# EAGLE design H0FR1 (EAGLE 9.6.1)

## Sheet 1 of 2
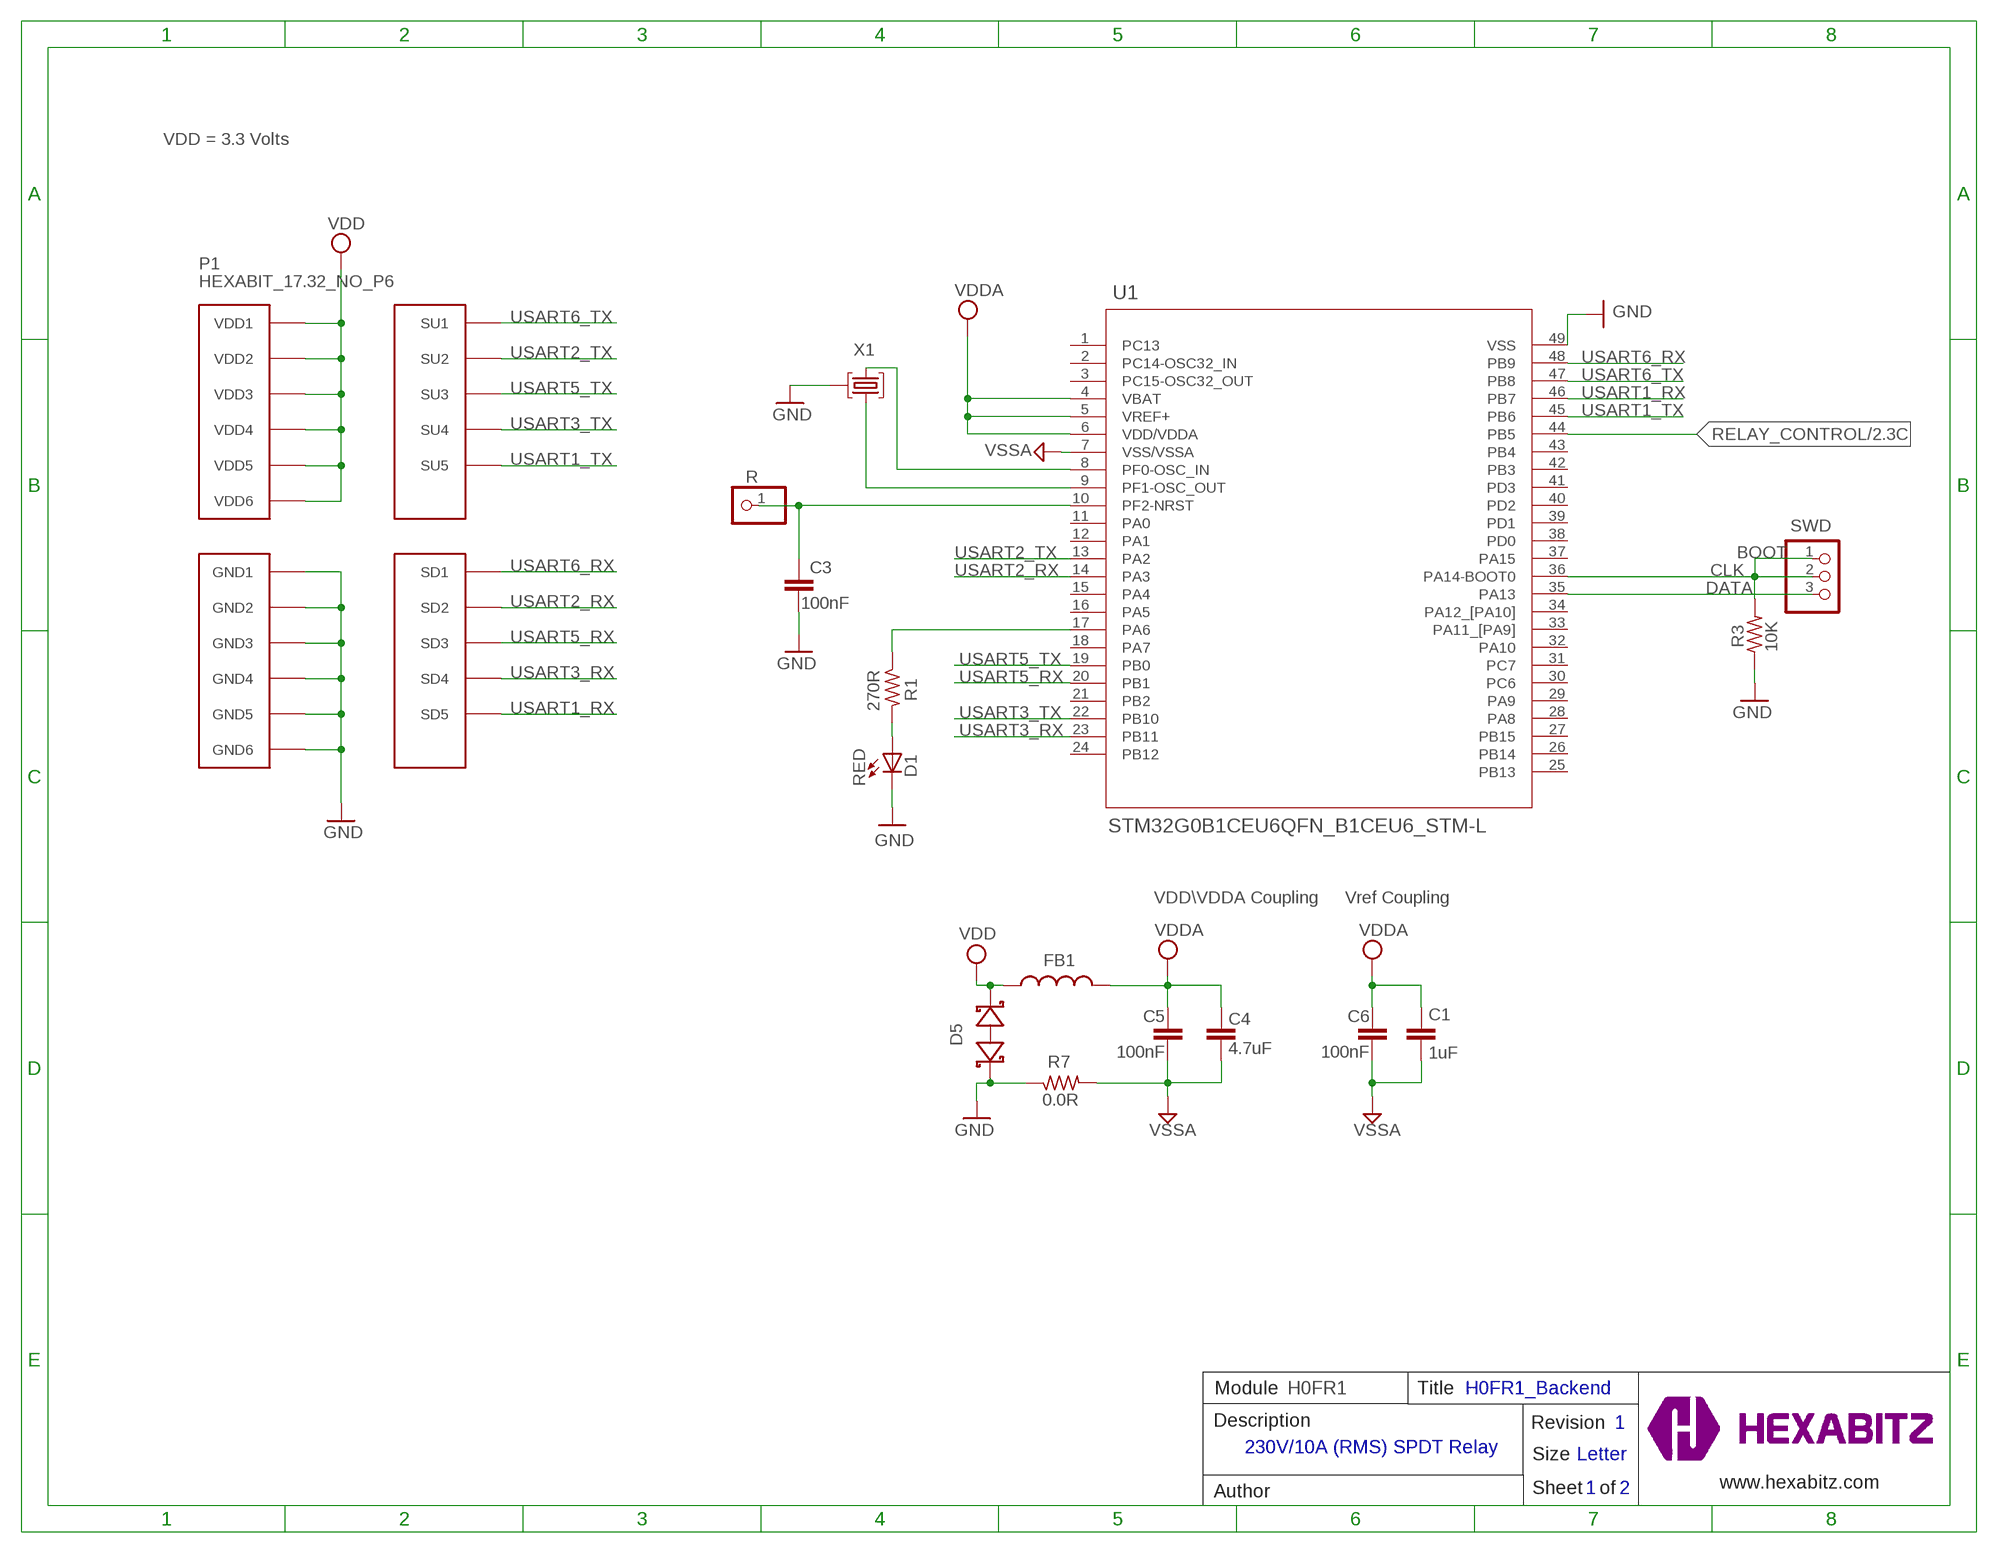
[diagram p0: schematic, sheet 1]

### Parts
C1  1uF  C-0805  [C-0805]
C3  100nF  C-0603  [C-0603]
C4  4.7uF  C-0805  [C-0805]
C5  100nF  C-0603  [C-0603]
C6  100nF  C-0603  [C-0603]
D1  RED  VLMS1300-GS08  [VLMS1300-GS08]
D5  BOURNS_CDSOD323-T03SCBOURNS_CDSOD323-T03SC_0_0  [BOURNS_CDSOD323-T03SC_0]
FB1  FB-TDK_MMZ1608Y300B  FB-0603  [FB-0603]
P1  HEXABIT_17.32_NO_P6  [HEXABIT_17.32_NO_P6]
R  R  PINHD-1X1  [1X01]
R1  270R  R-0603  [R-0603]
R3  10K  R-0603  [R-0603]
R7  0.0R  R-0603  [R-0603]
SWD  PINHD-1X3  [1X03]
TRIMBLE-LOGO1  HEXA-LOGO  [HEXA-LOGO]
U1  STM32G0B1CEU6QFN_B1CEU6_STM-L  [QFN_B1CEU6_STM-L]
X1  XTALL_CSTCE8M00G52  [XTALL_CSTCE8M00G52]

### Nets
CLK: R3.2 SWD.1 SWD.2 U1.36(PA14-BOOT0)
DATA: SWD.3 U1.35(PA13)
GND: C3.2 D1.C D5.1(A) P1.PAD_PD7(GND1) P1.PAD_PD8(GND2) P1.PAD_PD9(GND3) P1.PAD_PD10(GND4) P1.PAD_PD11(GND5) P1.PAD_PD12(GND6) R3.1 R7.1 U1.49(VSS) X1.P$2 ; also sheet 2
N$2: D1.A R1.2
N$3: R1.1 U1.17(PA6)
N$4: C3.1 R.1 U1.10(PF2-NRST)
N$5: U1.9(PF1-OSC_OUT) X1.P$1
N$6: U1.8(PF0-OSC_IN) X1.P$3
RELAY_CONTROL: U1.44(PB5) ; also sheet 2
USART1_RX: P1.PAD_PD5(SD5) U1.46(PB7)
USART1_TX: P1.PAD_PU5(SU5) U1.45(PB6)
USART2_RX: P1.PAD_PD2(SD2) U1.14(PA3)
USART2_TX: P1.PAD_PU2(SU2) U1.13(PA2)
USART3_RX: P1.PAD_PD4(SD4) U1.23(PB11)
USART3_TX: P1.PAD_PU4(SU4) U1.22(PB10)
USART5_RX: P1.PAD_PD3(SD3) U1.20(PB1)
USART5_TX: P1.PAD_PU3(SU3) U1.19(PB0)
USART6_RX: P1.PAD_PD1(SD1) U1.48(PB9)
USART6_TX: P1.PAD_PU1(SU1) U1.47(PB8)
VDD: D5.2(C) FB1.2 P1.PAD_PU7(VDD1) P1.PAD_PU8(VDD2) P1.PAD_PU9(VDD3) P1.PAD_PU10(VDD4) P1.PAD_PU11(VDD5) P1.PAD_PU12(VDD6) ; also sheet 2
VDDA: C1.1 C4.1 C5.1 C6.1 FB1.1 U1.4(VBAT) U1.5(VREF+) U1.6(VDD/VDDA)
VSSA: C1.2 C4.2 C5.2 C6.2 R7.2 U1.7(VSS/VSSA)
Unconnected: U1.1(PC13) U1.2(PC14-OSC32_IN) U1.3(PC15-OSC32_OUT) U1.11(PA0) U1.12(PA1) U1.15(PA4) U1.16(PA5) U1.18(PA7) U1.21(PB2) U1.24(PB12) U1.25(PB13) U1.26(PB14) U1.27(PB15) U1.28(PA8) U1.29(PA9) U1.30(PC6) U1.31(PC7) U1.32(PA10) U1.33(PA11_[PA9]) U1.34(PA12_[PA10]) U1.37(PA15) U1.38(PD0) U1.39(PD1) U1.40(PD2) U1.41(PD3) U1.42(PB3) U1.43(PB4)

### Notes on the sheet
- VDD = 3.3 Volts
- BOOT
- VDD\VDDA Coupling | Vref Coupling
- Module | H0FR1 | Title | H0FR1_Backend
- Description | Revision | 1
- 230V/10A (RMS) SPDT Relay
- Size | Letter
- www.hexabitz.com
- Author | Sheet   of | 1 | 2
- C:/Users/Admin/Desktop/logodraft.bmp

## Sheet 2 of 2
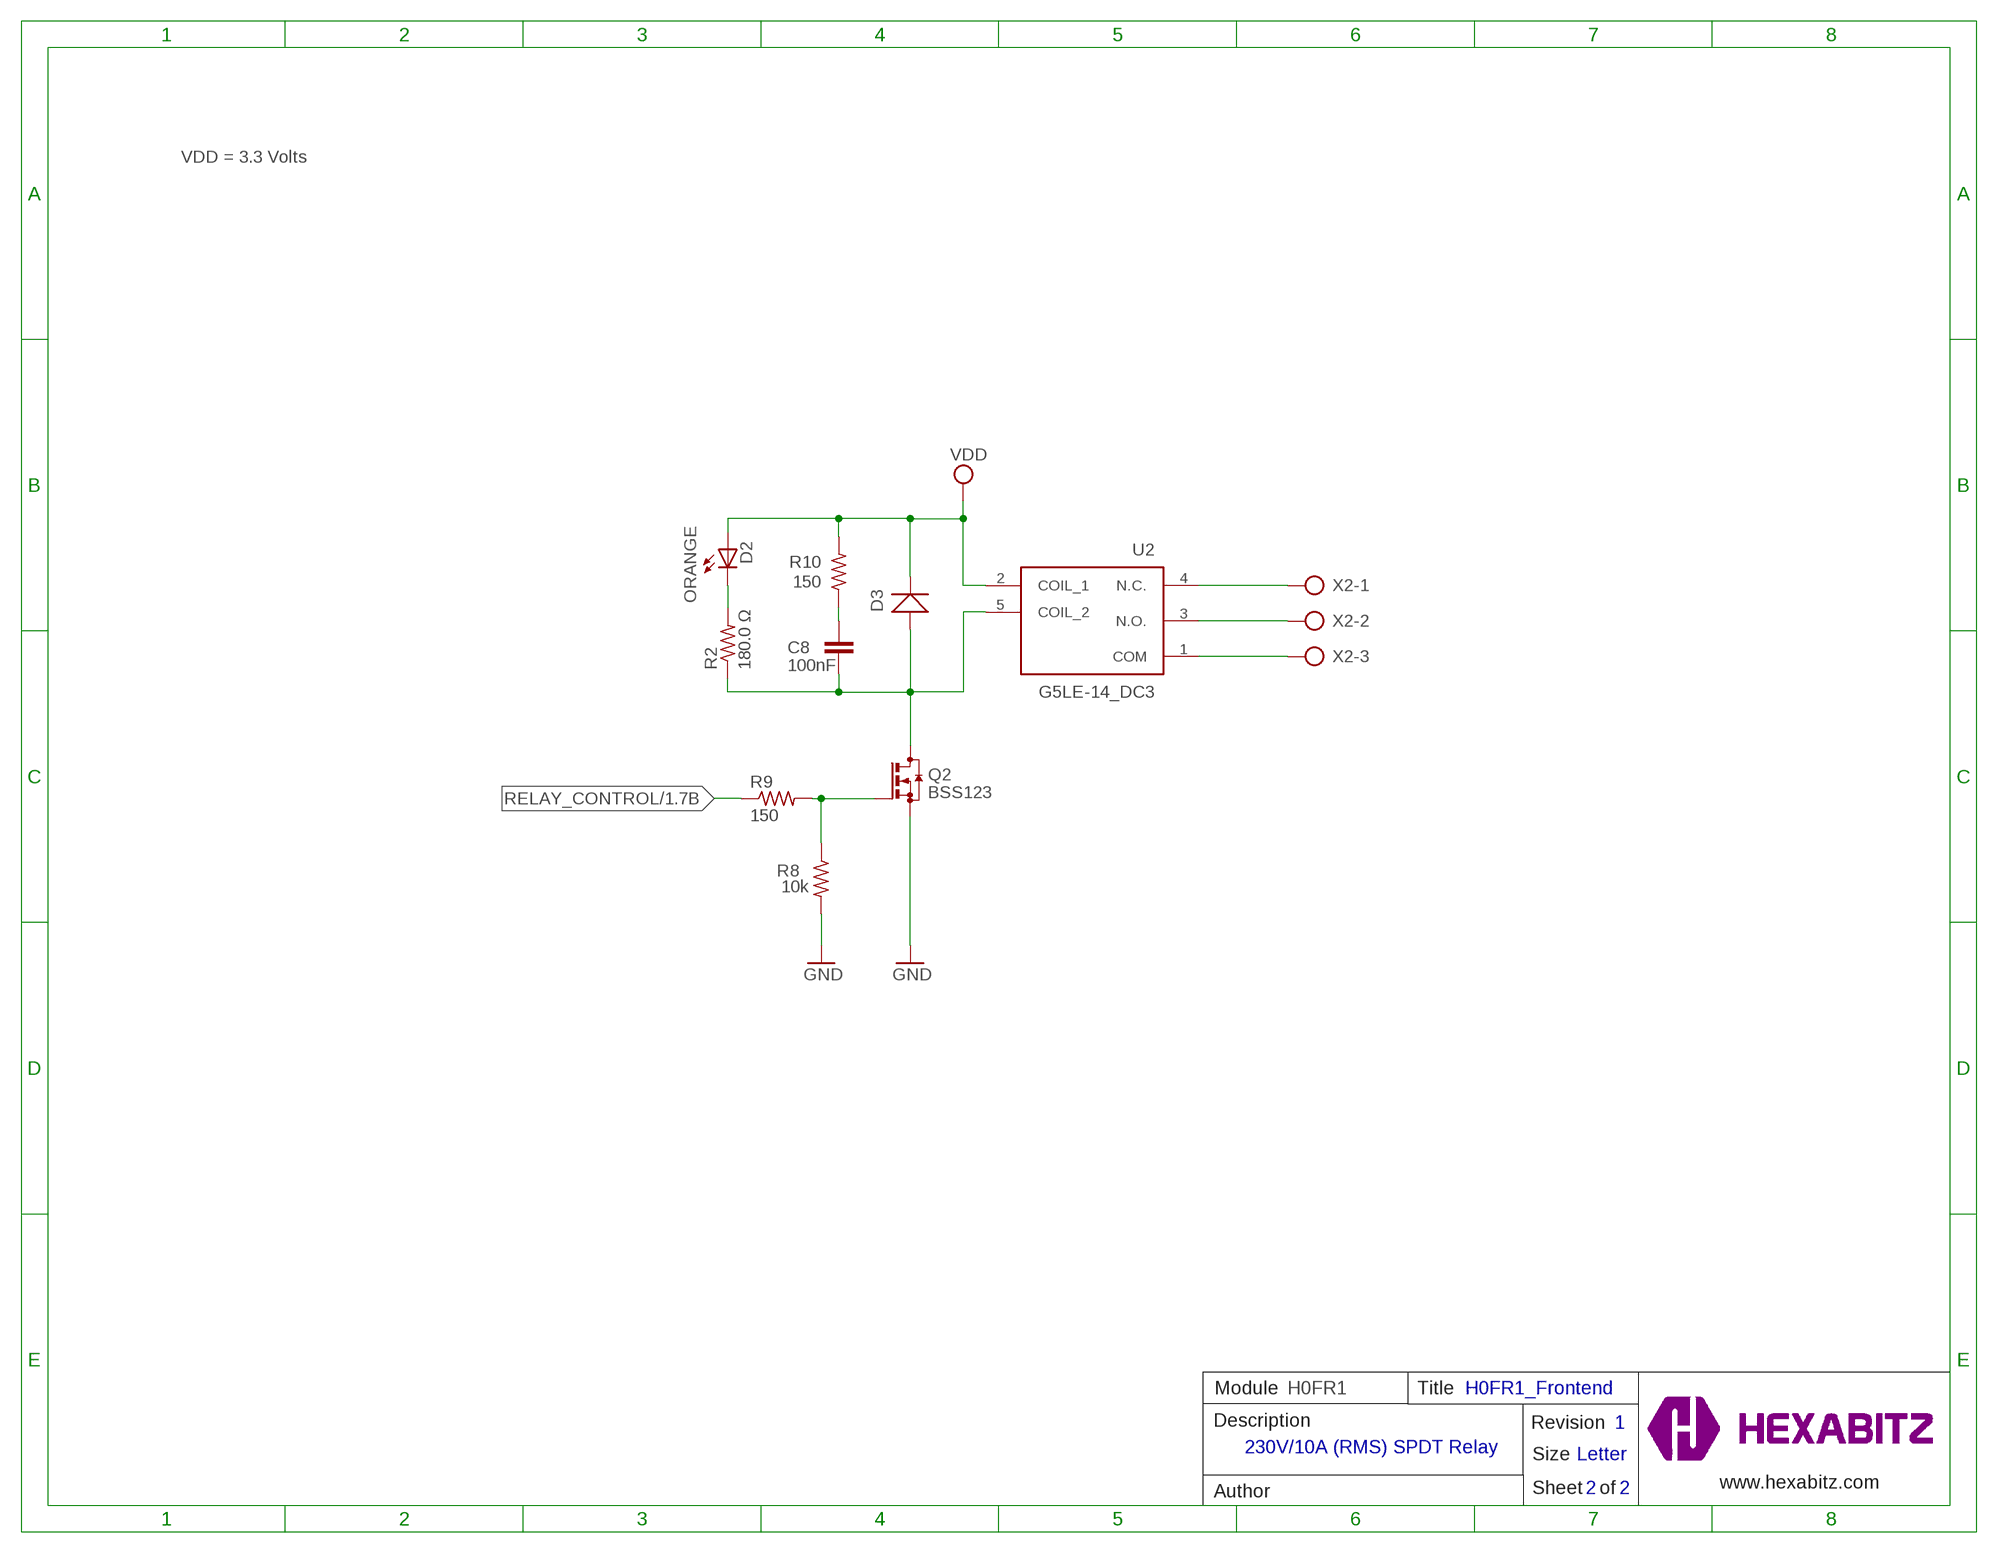
[diagram p1: schematic, sheet 2]

### Parts
C8  100nF  C-0603  [C-0603]
D2  orange  VLMS1300-GS08  [VLMS1300-GS08]
D3  40V 300MA  BAT54JFILM_SOD-323  [SOD-323]
Q2  BSS123  [SOT23]
R2  180.0 Ω  R-0603  [R-0603]
R8  10k  R-0603  [R-0603]
R9  150  R-0603  [R-0603]
R10  150  R-0603  [R-0603]
U2  G5LE-14_DC3  [G5LE-14_SPDT]
X2  AK300/3  [AK300/3]

### Nets
COM [ac]: U2.1(COM) X2.3
GND: Q2.2(S) R8.2 ; also sheet 1
N$1: C8.2 D3.+ Q2.3(D) R2.1 U2.5(COIL_2)
N$8: D2.C R2.2
N$11: Q2.1(G) R8.1 R9.2
N$12: C8.1 R10.1
NC [ac]: U2.4(N.C.) X2.1
NO [ac]: U2.3(N.O.) X2.2
RELAY_CONTROL: R9.1 ; also sheet 1
VDD: D2.A D3.- R10.2 U2.2(COIL_1) ; also sheet 1

### Notes on the sheet
- VDD = 3.3 Volts
- Module | H0FR1 | Title | H0FR1_Frontend
- Description | Revision | 1
- 230V/10A (RMS) SPDT Relay
- Size | Letter
- www.hexabitz.com
- Author | Sheet   of | 2 | 2

## Library data of the parts
C1 C4 = HEXABITZ_RCLS:C-0805: CAP CER 10% X7R 0805
C3 C5 C6 = HEXABITZ_RCLS:C-0603: CAP CER 10% X7R 0603
C8 = HEXABITZ_RCLS:C-0603: CAP CER 10% X7R 0603; CAPACITANCE: 100nF; MFN: KEMET; MPN: C0603C104K8RACTU; OCTOPART_URL: https://octopart.com/c0603c104k8ractu-kemet-145075?r=sp&s=9bS9ASSwSEqMCE9KBEQZ0g; TOLERANCE: 10%; VOLTAGE_RATING: 10V
D1 = HEXABITZ_USER_INTERFACE_PARTS:VLMS1300-GS08: Red 0603 130° Clear 54 mcd 2 V Surface Mount ChipLED ; Octopart Url : http://octopart.com/vlms1300-gs08-vishay-21709201; MFN: Vishay; MPN: VLMS1300-GS08; OCTOPART_URL: https://octopart.com/vlms1300-gs08-vishay-21709201?r=sp&s=_gcP4_q8T1SC6PJQPTQ9yA
D2 = Hexabitz:VLMS1300-GS08: Red 0603 130° Clear 54 mcd 2 V Surface Mount ChipLED ; Octopart Url : http://octopart.com/vlms1300-gs08-vishay-21709201; COULOR: ORANGE; MFN: Vishay; MPN: VLMY1300-GS08; OCTOPART_URL: https://octopart.com/vlmy1300-gs08-vishay-21709204; VALUE: RED
D3 = HEXABITZ_RCLS:BAT54JFILM_SOD-323: 304020019; MPN: BAT54JFILM
D5 = HEXABITZ_RCLS:BOURNS_CDSOD323-T03SC: CDSOD323-TxxSC - TVS Diode Series; DESCRIPTION: Dio Tvs Vwm 03V 500W Bidir Sod323 / Tape & Reel - 7" Reel; MFN: Bourns; MPN: CDSOD323-T03SC; OCTOPART_URL: https://octopart.com/cdsod323-t03sc-bourns-10487153?r=sp
FB1 = HEXABITZ_RCLS:FB-0603: Ferrite Beads Multi-Layer 0603; MFN: TDK; MPN: MMZ1608Y300B; OCTOPART_URL: https://octopart.com/mmz1608y300b-tdk-368280?r=sp&s=cd9_2ZEqQ9q9UNBuQgHAiA
P1 = hexabitz_connectors:HEXABIT_?_NO_P6: Hexabitz Hexagon Module Connector Hexagon side length = 17.32mm. The following ports are removed: P6
Q2 = HEXABITZ_RCLS:BSS123: N-CHANNEL MOS FET; DESCRIPTION: Transistor MOSFET Negative Channel 100 Volt 0.17A 3-Pin SOT-23; MFN: ON Semiconductor; MPN: BSS123; OCTOPART_URL: https://octopart.com/bss123-on+semiconductor-20837328?r=sp
R = HEXABITZ_USER_INTERFACE_PARTS:PINHD-1X1: PIN HEADER; MFN: TE Connectivity; MPN: 87227-1; OCTOPART_URL: https://octopart.com/87227-1-te+connectivity-39512052?r=sp
R1 R3 = HEXABITZ_RCLS:R-0603: Thick Film Resistors - SMD 0603
R2 = HEXABITZ_RCLS:R-0603: Thick Film Resistors - SMD 0603; MFN: Panasonic; MPN: ERJ-3GEYJ181V; OCTOPART_URL: https://octopart.com/erj-3geyj181v-panasonic-55403673; RESISTANCE: 180.0 Ω; TOLERANCE: ±5%
R7 = HEXABITZ_RCLS:R-0603: Thick Film Resistors - SMD 0603; MFN: Yageo; MPN: RC0603JR-070RL; OCTOPART_URL: https://octopart.com/rc0603jr-070rl-yageo-1241539?r=sp&s=X2NteqRjRNWrnx42Y0aliA; RESISTANCE: 0.0 Ohm
R8 R10 = HEXABITZ_RCLS:R-0603: Thick Film Resistors - SMD 0603; MFN: Yageo; MPN: RC0603JR-07680KL; OCTOPART_URL: https://octopart.com/rc0603jr-07680kl-yageo-40953169?r=sp; RESISTANCE: 680K Ohm; TOLERANCE: 5%
R9 = HEXABITZ_RCLS:R-0603: Thick Film Resistors - SMD 0603; MFN: Vishay; MPN: CRCW06031K00JNEA; OCTOPART_URL: https://octopart.com/crcw06031k00jnea-vishay-55388219?r=sp; RESISTANCE: 1000.0 Ω; TOLERANCE: ±5%
SWD = pinhead:PINHD-1X3: PIN HEADER
TRIMBLE-LOGO1 = HEXABITZ_USER_INTERFACE_PARTS:HEXA-LOGO: Trimble-Logo
U1 = HEXABITZ_ICs:STM32G0B1CEU6; COPYRIGHT: Copyright (C) 2021 Ultra Librarian. All rights reserved.; MANUFACTURER_PART_NUMBER: STM32G0B1CEU6; MFR_NAME: STMicroelectronics; SPICEPREFIX: X
U2 = HEXABITZ_OTHER_PARTS:G5LE-14_DC: General Purpose Relays Power PCB Relay Source: Datasheet <https://omronfs.omron.com/en_US/ecb/products/pdf/en-g5le.pdf>; DESCRIPTION: General Purpose Relays Power PCB Relay; HEIGHT: mm; MANUFACTURER_NAME: Omron Electronics; MANUFACTURER_PART_NUMBER: G5LE-14 DC3; MOUSER_PART_NUMBER: 653-G5LE-14DC3; MOUSER_PRICE-STOCK: https://www.mouser.com/Search/Refine.aspx?Keyword=653-G5LE-14DC3
X1 = HEXABITZ_RCLS:XTALL_CSTCE8M00G52: MURATA CSTCE8M00G52-R0 RESONATOR, SMD, 8MHZ ; Octopart Url : https://octopart.com/cstce8m00g52-r0-murata-7145559; MFN: Murata; MPN: CSTCE8M00G52Z-R0; OCTOPART_URL: https://octopart.com/cstce8m00g52z-r0-murata-17755941?r=sp&s=JDnNJnrHQhyS8Zk4ofFWXw
X2 = HEXABITZ_CONNECTION_PARTS:AK300/3: CONNECTOR; OC_FARNELL: unknown; OC_NEWARK: unknown

## Net classes
1 ac: clearance 1.016 mm

## Board
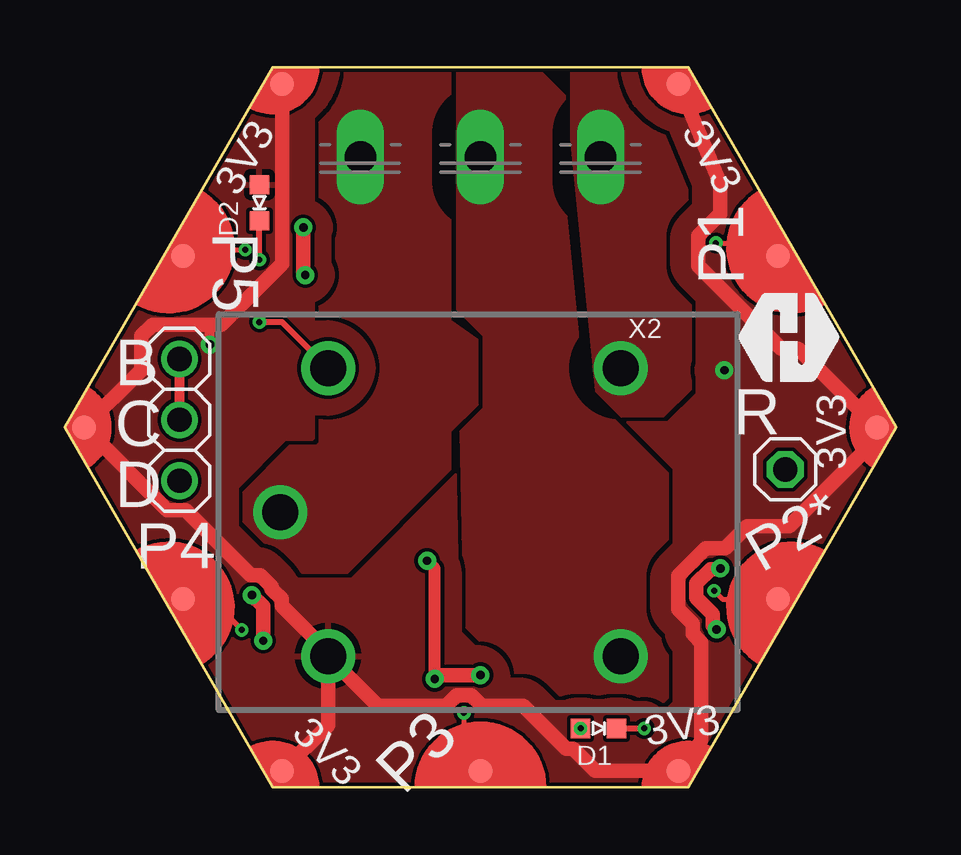
[diagram p2: board, top side]
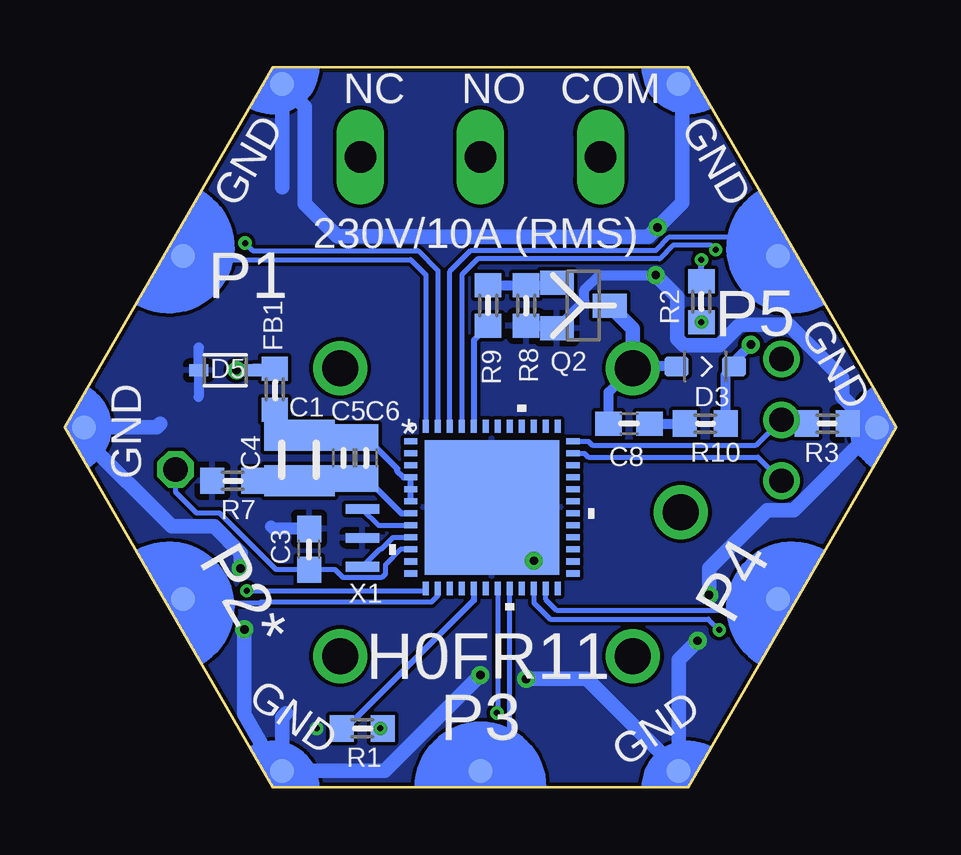
[diagram p3: board, bottom side, seen from below]

Size 34.64 x 30 mm. Coordinates in mm from the lower left corner, seen from the top.
Copper layers (1*16): Top 0.035mm / dielectric 1.5mm / Bottom 0.035mm
Design rules "2_layer *": minimum track width 6mil, minimum drill 9mil, track to track 6mil, track to pad 6mil, pad to pad 6mil, via to via 6mil, smd to smd 0mil, copper to edge 0.15mm, drill to drill 8mil, minimum pad ring 10mil, minimum via ring 6mil, stop-mask expansion 2mil, vias tented up to drill 15mil, thermal gap 10mil

### Footprints (pad centres in the part's own frame; a part is rotated, then mirrored left to right if it is on the bottom)
C-0805 = smd 1.3 x 1.5: 1 -0.95,0; 2 0.95,0
C-0603 = smd 1.1 x 1: 1 -0.85,0; 2 0.85,0
VLMS1300-GS08 = smd 0.8 x 0.8: A 0,0.75; C 0,-0.75
SOD-323 = smd 1 x 0.8: + -1.2,0; - 1.2,0
BOURNS_CDSOD323-T03SC_0 = smd 0.8 x 0.5: 1 -1.1,0; 2 1.1,0
FB-0603 = smd 1 x 1.1: 1 -0.85,0; 2 0.85,0
HEXABIT_17.32_NO_P6 = smd 1 x 1 bottom: PAD_PD1 12.39,7.15; PAD_PD2 12.39,-7.15; PAD_PD3 0,-14.31; PAD_PD4 -12.39,-7.15; PAD_PD5 -12.39,7.15; PAD_PD7 8.26,14.31; PAD_PD8 16.52,0; PAD_PD9 8.26,-14.31; PAD_PD10 -8.26,-14.31; PAD_PD11 -16.52,0; PAD_PD12 -8.26,14.31 | smd 1 x 1: PAD_PU1 12.39,7.15; PAD_PU2 12.39,-7.15; PAD_PU3 0,-14.31; PAD_PU4 -12.39,-7.15; PAD_PU5 -12.39,7.15; PAD_PU7 8.26,14.31; PAD_PU8 16.52,0; PAD_PU9 8.26,-14.31; PAD_PU10 -8.26,-14.31; PAD_PU11 -16.52,0; PAD_PU12 -8.26,14.31
SOT23 = smd 1 x 1.4: 1 -0.95,-1.1; 2 0.95,-1.1; 3 0,1.1
1X01 = drill 1.016 octagon: 1 0,0
R-0603 = smd 1 x 1.1: 1 -0.85,0; 2 0.85,0
1X03 = drill 1.016: 1 -2.54,0; 2 0,0; 3 2.54,0
QFN_B1CEU6_STM-L = smd 0.55 x 0.254: 1 -3.38,2.751; 2 -3.38,2.251; 3 -3.38,1.75; 4 -3.38,1.25; 5 -3.38,0.75; 6 -3.38,0.25; 7 -3.38,-0.25; 8 -3.38,-0.75; 9 -3.38,-1.25; 10 -3.38,-1.75; 11 -3.38,-2.251; 12 -3.38,-2.751; 25 3.38,-2.751; 26 3.38,-2.251; 27 3.38,-1.75; 28 3.38,-1.25; 29 3.38,-0.75; 30 3.38,-0.25; 31 3.38,0.25; 32 3.38,0.75; 33 3.38,1.25; 34 3.38,1.75; 35 3.38,2.251; 36 3.38,2.751 | smd 0.254 x 0.55: 13 -2.751,-3.38; 14 -2.251,-3.38; 15 -1.75,-3.38; 16 -1.25,-3.38; 17 -0.75,-3.38; 18 -0.25,-3.38; 19 0.25,-3.38; 20 0.75,-3.38; 21 1.25,-3.38; 22 1.75,-3.38; 23 2.251,-3.38; 24 2.751,-3.38; 37 2.751,3.38; 38 2.251,3.38; 39 1.75,3.38; 40 1.25,3.38; 41 0.75,3.38; 42 0.25,3.38; 43 -0.25,3.38; 44 -0.75,3.38; 45 -1.25,3.38; 46 -1.75,3.38; 47 -2.251,3.38; 48 -2.751,3.38 | smd 5.6 x 5.6: 49 0,0
G5LE-14_SPDT = drill 1.5 pad 2.25: 1 -2,6; 2 0,0; 3 12.2,0; 4 12.2,12; 5 0,12
XTALL_CSTCE8M00G52 = smd 1.4 x 0.4: P$1 0,1.2; P$2 0,0; P$3 0,-1.2
AK300/3 = drill 1.321 long: 1 -5.004,0; 2 0,0; 3 5.004,0

### Placement (x,y rotation side)
C1  24.15,13.73 270 bottom
C3  24.46,9.92 90 bottom
C4  25.58,13.73 270 bottom
C5  23.04,13.73 270 bottom
C6  22.08,13.73 270 bottom
C8  11.13,15.16 180 bottom
D1  22.24,2.46 90 top
D2  8.11,24.37 0 top
D3  7.95,17.54 0 bottom
D5  27.96,17.38 0 bottom
FB1  25.89,16.59 90 bottom
P1  17.32,15 0 top
Q2  13.03,20.08 270 bottom
R  30.02,13.25 0 top
R1  22.24,2.46 0 bottom
R2  8.11,20.24 90 bottom
R3  2.87,15.16 180 bottom
R7  27.64,12.78 0 bottom
R8  15.42,20.08 270 bottom
R9  17,20.08 90 bottom
R10  7.95,15.16 0 bottom
SWD  4.78,15.32 270 top
TRIMBLE-LOGO1  30.18,16.9 0 top
U1  16.84,11.67 0 bottom
U2  10.97,5.47 0 top
X1  22.24,10.4 180 bottom
X2  17.32,26.27 180 top

### Tracks (layer width: path | path; a pad name or v marks a point on that pad's centre or on a via)
CLK
  Top 0.406: SWD.1 SWD.2
  Bottom 0.203: U1.36 12.83,14.42 12.67,14.26 5.84,14.26 SWD.2
  Bottom 0.406: SWD.2 4.62,15.16 R3.2
COM
  pour Top (no thermals): 10.65,29.92 10.65,14.36 10.49,14.21 9.38,14.21 7.48,12.3 7.48,10.24 8.75,8.97 11.76,8.97 16.05,13.25 16.05,14.84 17.16,15.95 17.16,18.65 16.05,19.45 16.05,29.92
DATA
  Bottom 0.203: U1.35 12.99,13.92 12.83,13.76 5.76,13.76 SWD.3
GND  (via drill 0.25 pad 0.55, 0.35 pad 0.75)
  Top 0.254: D1.C v24.15,2.46
  Top 0.508: v15.42,4.52 15.42,9.13 v15.1,9.44
  Top 0.61: v9.94,23.33 9.94,21.43 v10.02,21.35 | v7.79,8.01 8.27,7.54 v8.27,6.11 | v15.42,4.52 15.57,4.68 v17.32,4.68 | v27.31,9.13 27.28,9.09 26.91,9.09 26.32,8.5 26.32,7.89 27,7.22 27,6.74 v27.16,6.58
  Bottom 0.406: R8.2 14.23,19.23 Q2.2 12.99,20.27 12.99,20.73 12.37,21.35 v10.02,21.35 | 29.07,16.27 D5.1 29.06,18.32 29.07,18.33
  Bottom 0.508: v15.1,9.44 15.1,9.92 U1.49 | C3.2 25.95,10.77 26.05,10.87
  Bottom 0.61: P1.PAD_PD12 8.91,29.16 8.91,24.37 v9.94,23.33 10.34,22.94 19.86,22.94 19.89,22.97 23.28,22.97 24.64,24.32 24.64,28.36 P1.PAD_PD7 25.58,25.01 25.58,25 | v10.02,21.35 9.12,20.45 9.12,18.7 8.85,18.43 7.37,18.43 6.52,19.29 4.48,19.29 2.24,17.04 2.24,16.27 0.97,15 P1.PAD_PD11 0.83,15 4.27,11.56 5.36,11.56 7.79,9.13 v7.79,8.01 | v8.27,6.11 9.06,5.32 P1.PAD_PD10 12.89,4.52 v15.42,4.52 | v17.32,4.68 21.31,0.69 22.72,0.69 P1.PAD_PD9 | 24.46,0.69 P1.PAD_PD9 | P1.PAD_PD9 26.09,1.2 27.16,3.05 v27.16,6.58 | v27.31,9.13 27.31,9.76 28.42,10.87 30.19,10.87 33.84,14.52 P1.PAD_PD8 30.81,15 30.66,15.16 | P1.PAD_PD9 25.58,2.93 25.42,3.09
  pour Bottom (rank 2): 0.18,32.14 26.53,32.14 34.15,24.52 36.21,22.46 36.21,9.29 36.21,7.86 27.48,-0.88 5.26,-0.88 -2.52,6.9 -2.52,29.13 -2.52,29.61 0.02,32.14
N$1  (via drill 0.25 pad 0.55)
  Top 0.254: U2.5 9.06,19.39 R2.1
  Bottom 0.406: D3.+ 11.04,17.54 U2.5 11.98,16.47 C8.2
  Bottom 0.61: Q2.3 10.97,19.12 U2.5
  other vias: 8.11,19.39
N$2  (via drill 0.25 pad 0.55)
  Bottom 0.254: R1.2 21.39,2.04 21.43,2.4 D1.A
  other vias: 21.49,2.46
N$3
  Bottom 0.254: U1.17 17.59,7.8 22.93,2.46 R1.1
N$4
  Bottom 0.203: U1.10 20.66,9.92 21.29,9.29 21.29,8.89 21.44,8.74 23.05,8.74 23.37,9.07 C3.1 25.83,9.07 28.19,11.43 29.15,11.43 30.02,12.3 R.1
N$5
  Bottom 0.203: X1.P$1 21.5,9.94 21.44,9.94 20.96,10.42 U1.9
N$6
  Bottom 0.203: X1.P$3 21.56,10.92 U1.8
N$8  (via drill 0.25 pad 0.55)
  Top 0.254: v8.11,21.98 D2.C
  Bottom 0.254: R2.2 v8.11,21.98
N$11
  Bottom 0.406: R9.2 R8.1 14.23,20.93 Q2.1
N$12
  Bottom 0.406: 8.75,15.16 R10.1 C8.1
NC
  pour Top (no thermals): 21.13,29.92 21.13,27.04 22.17,16.5 23.19,15.48 24.94,15.48 26.05,16.59 26.05,27.06 23.19,29.92
NO
  pour Top (no thermals): 16.37,30.08 16.37,19.92 17.48,18.81 17.48,15.79 16.53,14.84 16.7,6.73 19.86,3.57 24.94,3.57 25.1,3.73 25.1,13.09 21.58,16.61 20.81,24.4 20.81,28.81 19.54,30.08
RELAY_CONTROL
  Bottom 0.254: R9.1 17.59,18.64 U1.44
USART1_RX
  Bottom 0.203: U1.46 18.59,21.5 17.72,22.38 10,22.38 9.45,22.94 5.72,22.94 P1.PAD_PD5
USART1_TX  (via drill 0.25 pad 0.55)
  Top 0.203: P1.PAD_PU5 5.19,22.41 v7.52,22.41
  Bottom 0.203: v7.52,22.41 7.7,22.58 9.3,22.58 9.86,22.02 17.44,22.02 18.09,21.37 U1.45
USART2_RX
  Bottom 0.203: U1.14 19.09,7.99 19.36,7.72 26.47,7.72 26.52,7.67 29.53,7.67 P1.PAD_PD2
USART2_TX  (via drill 0.25 pad 0.55)
  Top 0.203: v27.05,8.2 27.4,7.85 P1.PAD_PU2
  Bottom 0.203: U1.13 19.68,8.2 v27.05,8.2
USART3_RX
  Bottom 0.203: P1.PAD_PD4 5.72,7.06 6.17,7.06 6.47,7.37 14.13,7.37 14.59,7.83 U1.23
USART3_TX  (via drill 0.25 pad 0.55)
  Top 0.203: v7.37,6.56 6.08,7.85 P1.PAD_PU4
  Bottom 0.203: U1.22 15.09,7.69 14.41,7.01 7.82,7.01 v7.37,6.56
USART5_RX
  Bottom 0.203: P1.PAD_PD3 16.09,1.92 U1.20
USART5_TX  (via drill 0.25 pad 0.55)
  Top 0.203: v16.63,3.11 16.63,1.38 P1.PAD_PU3
  Bottom 0.203: U1.19 16.59,3.15 v16.63,3.11
USART6_RX
  Bottom 0.203: U1.48 19.59,21.36 20.23,21.99 29.55,21.99 P1.PAD_PD1
USART6_TX  (via drill 0.25 pad 0.55)
  Top 0.203: v27.13,22.68 29.18,22.68 P1.PAD_PU1
  Bottom 0.203: U1.47 19.09,21.54 19.92,22.36 26.81,22.36 v27.13,22.68
VDD  (via drill 0.35 pad 0.75)
  Top 0.406: v6.05,18.45 6.05,19.13 5.89,19.29
  Top 0.61: P1.PAD_PU7 27.32,25.16 27.32,23.91 26.4,22.99 26.4,21.74 29.85,18.29 30.55,18.29 P1.PAD_PU8 33.84,14.52 30.19,10.87 28.43,10.87 27.52,9.96 26.7,9.96 25.56,8.82 25.56,7.42 26.16,6.81 26.16,6.4 26.53,6.03 26.53,1.96 26.09,1.2 P1.PAD_PU9 22.11,0.69 21.19,1.6 20.9,1.6 19.09,3.41 17.37,3.41 16.94,3.84 16.33,3.84 15.9,3.41 14.94,3.41 13.03,3.41 U2.2 | U2.2 10.97,2.6 P1.PAD_PU10 | U2.2 10.97,5.63 9.03,7.57 9.03,7.85 8.63,8.26 8.63,8.36 8.14,8.85 7.76,8.85 5.04,11.56 4.27,11.56 0.83,15 P1.PAD_PU11 3.19,17.39 3.19,18.81 3.67,19.29 5.89,19.29 6.53,19.29 9.06,21.82 P1.PAD_PU12
  Bottom 0.406: v6.05,18.45 6.75,17.75 D3.- 7.1,17.19 R10.2 | v27.48,17.38 D5.2 26.8,17.44 FB1.2
  pour Top (rank 2): 0.65,31.51 27,31.51 34.62,23.89 36.69,21.83 36.69,8.65 36.69,7.22 27.96,-1.51 5.73,-1.51 -2.05,6.27 -2.05,28.49 -2.05,28.97 0.49,31.51
  pour Top (rank 2): 0.18,31.99 26.53,31.99 34.15,24.37 36.21,22.3 36.21,9.13 36.21,7.7 27.48,-1.03 5.26,-1.03 -2.52,6.74 -2.52,28.97 -2.52,29.45 0.02,31.99
VDDA
  Bottom 0.254: U1.6 U1.5 U1.4 20.52,12.92 20.78,13.17 20.78,13.28 C6.1 C5.1 24.05,14.58 C1.1 C4.1 25.89,15 FB1.1
VSSA
  Bottom 0.254: R7.2 C4.2 C1.2 23.14,12.78 C5.2 C6.2 20.62,11.42 U1.7

### Text on the board
tPlace: 3V3 | 3V3 | P1 | P5 | B | R | 3V3 | C | D | P2* | P4 | 3V3 | 3V3 | P3
bPlace: COM | NO | NC | GND | GND | 230V/10A (RMS) | P1 | P5 | GND | GND | P4 | P2* | H0FR11 | GND | P3 | GND
tDocu: Note: This module should be / manufactured with 1oz copper / to handle 4A current.